# EasyEDA schematic Schematic.json
TITLE: Cхема1; REV: 1.0; Date: 2021-05-14; Sheet: 1/1; Drawn By: melechko; Company: Your Company
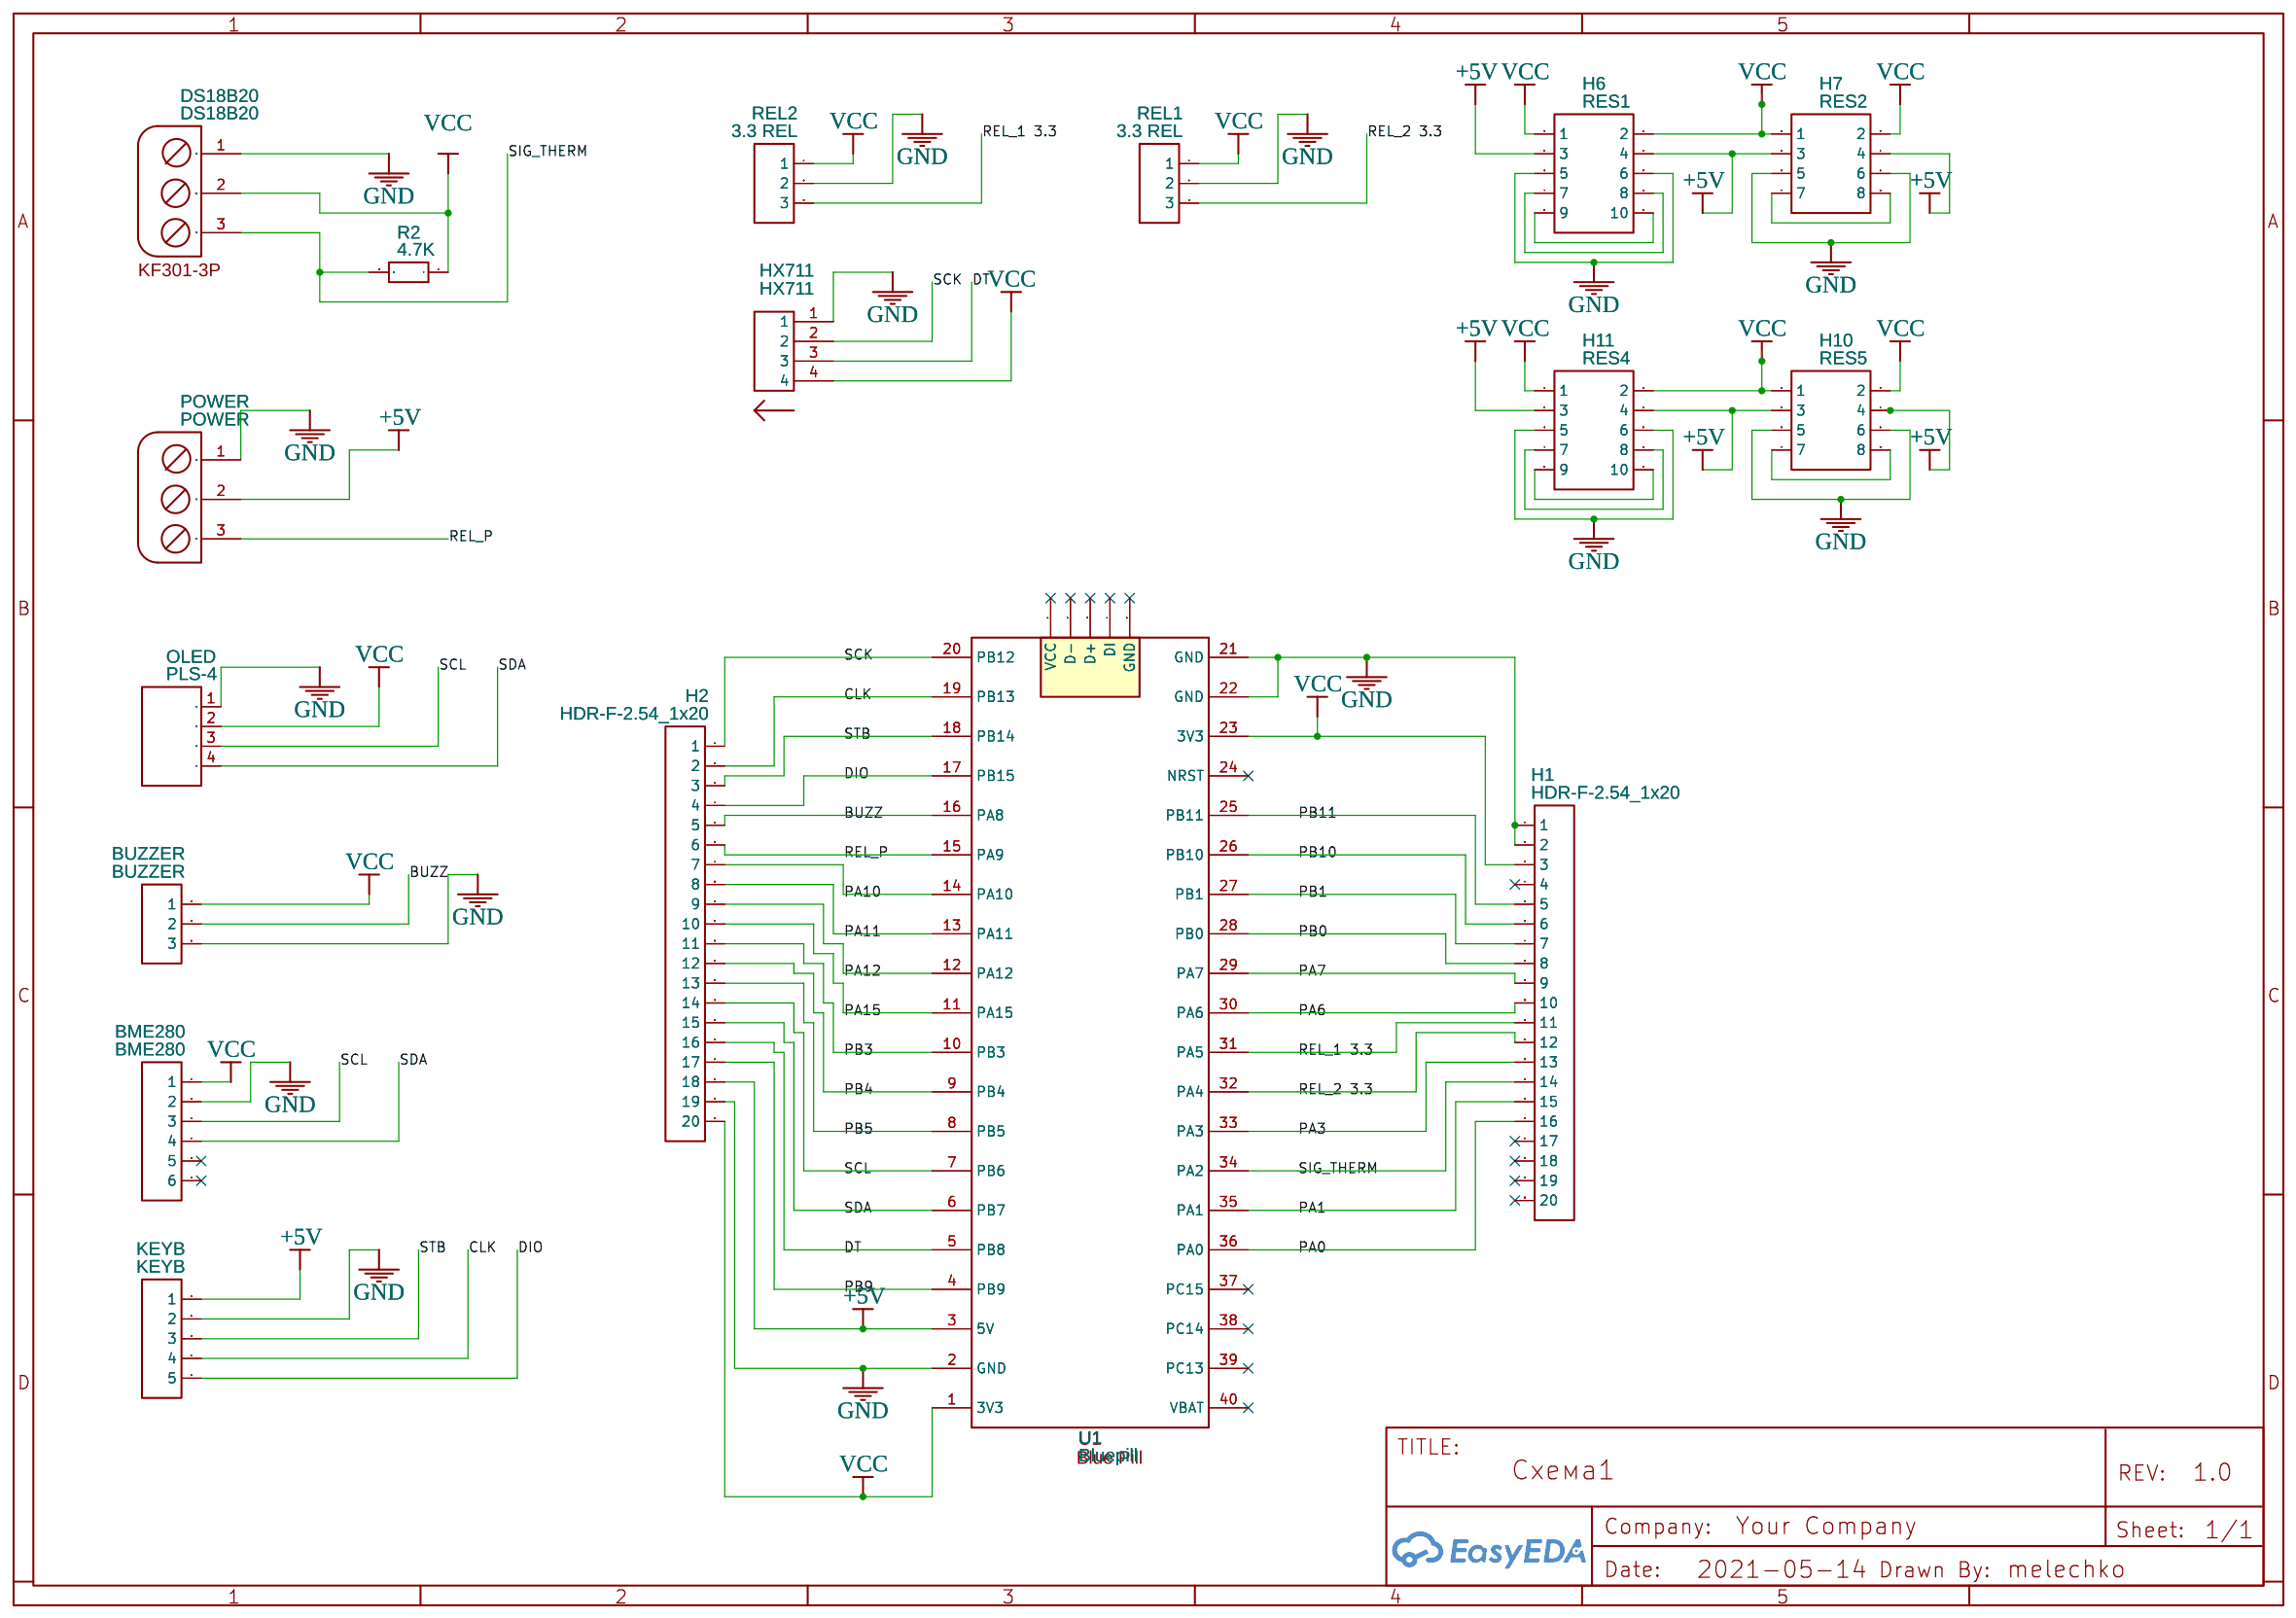
[diagram p0: schematic sheet]

## Parts
BME280  BME280  [HDR-F-2.54_1X6]
BUZZER  BUZZER  [HDR-F-2.54_1X3]
DS18B20  DS18B20  [DS18B20]
H1  HDR-F-2.54_1x20  [HDR-F-2.54_1X20]
H2  HDR-F-2.54_1x20  [HDR-F-2.54_1X20]
H6  RES1  [HDR-F-2.54_2X5]
H7  RES2  [HDR-F-2.54_2X4]
H10  RES5  [HDR-F-2.54_2X4]
H11  RES4  [HDR-F-2.54_2X5]
HX711  HX711  [PLS-4R (DS1022-1X4R)]
KEYB  KEYB  [HDR-F-2.54_1X5]
OLED  PLS-4  [PLS-4]
POWER  POWER  [KF301-3P]
R2  4.7K  [RES-TH_BD3.3-L9.2-P13.20-D0.6]
REL1  3.3 REL  [HDR-F-2.54_1X3]
REL2  3.3 REL  [HDR-F-2.54_1X3]
U1  Bluepill  [STM32F103C8T6-MODULE COPY]

## Library data of the parts
BME280 = HDR-F-2.54_1x6: Supplier Part: C40877; Supplier: LCSC; Contributor: LCEDA_Lib
BUZZER REL1 REL2 = HDR-F-2.54_1x3: Supplier Part: C146690; Supplier: LCSC; Contributor: LCEDA_Lib
DS18B20 = KF301-3P: Contributor: Vladis; Package Display: Yes
H1 H2 = HDR-F-2.54_1x20: Supplier Part: C50984; Supplier: LCSC; Contributor: LCEDA_Lib
H6 H11 = HDR-F-2.54_2x5: Supplier Part: C30419; Supplier: LCSC; Contributor: LCEDA_Lib
H7 H10 = HDR-F-2.54_2x4: Supplier Part: C239344; Supplier: LCSC; Contributor: LCEDA_Lib
HX711 = PLS-4R (DS1022-1x4R): Manufacturer: ART-SUS; Contributor: suslov.a
KEYB = HDR-F-2.54_1x5: Supplier Part: C50950; Supplier: LCSC; Contributor: LCEDA_Lib
OLED = PLS-4: Manufacturer Part: PLS-4 2,54 1x4; Contributor: popov_a_r
POWER = KF301-3P: Contributor: Vladis; Package Display: No
R2 = RN 1WS 4K7 F T/B A1: Supplier: LCSC; Supplier Part: C433646; Manufacturer: TyoHM; Contributor: LCSC; JLCPCB Part Class: Extended Part
U1 = Bluepill: Contributor: daiuchuu.ginga

## Nets
+5V: H2.18 H6.3 H6.4 H7.3 H7.4 H10.3 H10.4 H11.3 H11.4 KEYB.1 POWER.2 U1.3(D+)
GND: BME280.2 BUZZER.3 DS18B20.1(VCC) H1.1 H1.2 H2.19 H6.5 H6.6 H7.5 H7.6 H10.5 H10.6 H11.5 H11.6 HX711.1 KEYB.2 OLED.1 POWER.1 REL1.2 REL2.2 U1.2(D-) U1.21(GND) U1.22(GND)
VCC: BME280.1 BUZZER.1 DS18B20.2(GND) H1.3 H2.20 H6.1 H6.2 H7.1 H7.2 H10.1 H10.2 H11.1 H11.2 HX711.4 OLED.2 R2.1 REL1.1 REL2.1 U1.1(VCC) U1.23(3V3)
BUZZ: BUZZER.2 H2.5 U1.16(PA8)
CLK: H2.2 KEYB.4 U1.19(PB13)
DIO: H2.4 KEYB.5 U1.17(PB15)
DT: H2.16 HX711.3 U1.5(GND)
PA0: H1.16 U1.36(PA0)
PA1: H1.15 U1.35(PA1)
PA3: H1.13 U1.33(PA3)
PA6: H1.10 U1.30(PA6)
PA7: H1.9 U1.29(PA7)
PA10: H2.7 U1.14(PA10)
PA11: H2.8 U1.13(PA11)
PA12: H2.9 U1.12(PA12)
PA15: H2.10 U1.11(PA15)
PB0: H1.8 U1.28(PB0)
PB1: H1.7 U1.27(PB1)
PB3: H2.11 U1.10(PB3)
PB4: H2.12 U1.9(PB4)
PB5: H2.13 U1.8(PB5)
PB9: H2.17 U1.4(DI)
PB10: H1.6 U1.26(PB10)
PB11: H1.5 U1.25(PB11)
REL_1 3.3: H1.11 REL2.3 U1.31(PA5)
REL_2 3.3: H1.12 REL1.3 U1.32(PA4)
REL_P: H2.6 POWER.3 U1.15(PA9)
SCK: H2.1 HX711.2 U1.20(PB12)
SCL: BME280.3 H2.14 OLED.3 U1.7(PB6)
SDA: BME280.4 H2.15 OLED.4 U1.6(PB7)
SIG_THERM: DS18B20.3(SIG) H1.14 R2.2 U1.34(PA2)
STB: H2.3 KEYB.3 U1.18(PB14)
Net-(H6-7): H6.7 H6.8
Net-(H6-9): H6.9 H6.10
Net-(H7-7): H7.7 H7.8
Net-(H10-7): H10.7 H10.8
Net-(H11-7): H11.7 H11.8
Net-(H11-9): H11.9 H11.10

Not connected (* = marked no-connect by the designer): BME280 5* 6*; H1 4* 17* 18* 19* 20*; U1 24(NRST)* 37(PC15)* 38(PC14)* 39(PC13)* 40(VBAT)*
